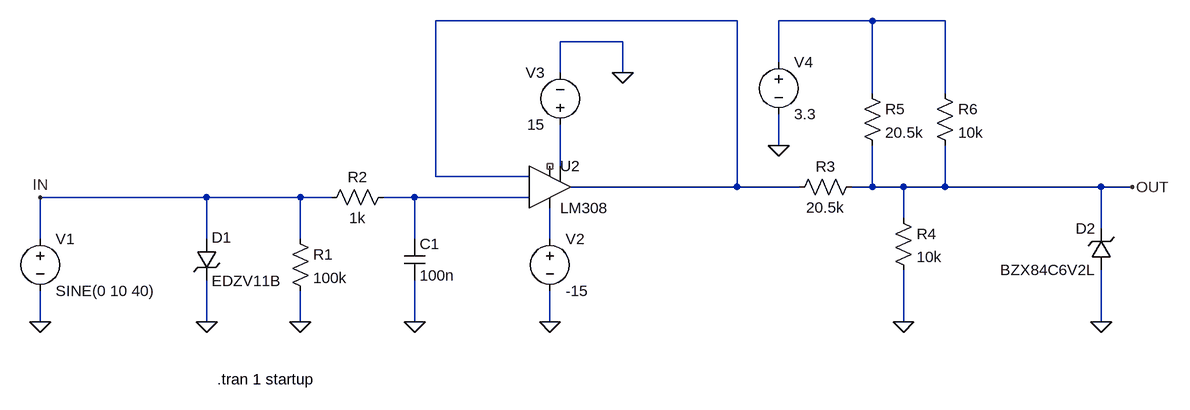
[diagram p0: schematic analog_input.asc]
analog_input.asc, the LTspice schematic file:
Version 4
SHEET 1 1540 680
WIRE 864 -208 400 -208
WIRE 1072 -208 928 -208
WIRE 1184 -208 1072 -208
WIRE 688 -176 592 -176
WIRE 928 -144 928 -208
WIRE 592 -128 592 -176
WIRE 688 -128 688 -176
WIRE 1072 -96 1072 -208
WIRE 1184 -96 1184 -208
WIRE 928 -16 928 -64
WIRE 592 16 592 -48
WIRE 400 32 400 -208
WIRE 544 32 400 32
WIRE 864 48 864 -208
WIRE 864 48 608 48
WIRE 960 48 864 48
WIRE 1072 48 1072 -16
WIRE 1072 48 1040 48
WIRE 1120 48 1072 48
WIRE 1184 48 1184 -16
WIRE 1184 48 1120 48
WIRE 1424 48 1184 48
WIRE 1472 48 1424 48
WIRE 48 64 -208 64
WIRE 192 64 48 64
WIRE 240 64 192 64
WIRE 368 64 320 64
WIRE 544 64 368 64
WIRE 1120 96 1120 48
WIRE 1424 112 1424 48
WIRE -208 128 -208 64
WIRE 48 128 48 64
WIRE 192 128 192 64
WIRE 368 128 368 64
WIRE 576 128 576 80
WIRE -208 256 -208 208
WIRE 48 256 48 192
WIRE 192 256 192 208
WIRE 368 256 368 192
WIRE 576 256 576 208
WIRE 1120 256 1120 176
WIRE 1424 256 1424 176
FLAG -208 256 0
FLAG 192 256 0
FLAG 368 256 0
FLAG 576 256 0
FLAG 688 -128 0
FLAG 1120 256 0
FLAG 928 -16 0
FLAG 1472 48 OUT
FLAG 48 256 0
FLAG 1424 256 0
FLAG -208 64 IN
SYMBOL voltage -208 112 R0
WINDOW 123 0 0 Left 0
WINDOW 39 0 0 Left 0
SYMATTR InstName V1
SYMATTR Value SINE(0 10 40)
SYMBOL res 176 112 R0
SYMATTR InstName R1
SYMATTR Value 100k
SYMBOL res 336 48 R90
WINDOW 0 0 56 VBottom 2
WINDOW 3 32 56 VTop 2
SYMATTR InstName R2
SYMATTR Value 1k
SYMBOL cap 352 128 R0
SYMATTR InstName C1
SYMATTR Value 100n
SYMBOL voltage 576 112 R0
WINDOW 123 0 0 Left 0
WINDOW 39 0 0 Left 0
SYMATTR InstName V2
SYMATTR Value -15
SYMBOL voltage 592 -32 R180
WINDOW 0 24 96 Left 2
WINDOW 3 24 16 Left 2
WINDOW 123 0 0 Left 0
WINDOW 39 0 0 Left 0
SYMATTR InstName V3
SYMATTR Value 15
SYMBOL res 1056 32 R90
WINDOW 0 0 56 VBottom 2
WINDOW 3 32 56 VTop 2
SYMATTR InstName R3
SYMATTR Value 20.5k
SYMBOL res 1104 80 R0
SYMATTR InstName R4
SYMATTR Value 10k
SYMBOL res 1056 -112 R0
SYMATTR InstName R5
SYMATTR Value 20.5k
SYMBOL res 1168 -112 R0
SYMATTR InstName R6
SYMATTR Value 10k
SYMBOL voltage 928 -160 R0
WINDOW 123 0 0 Left 0
WINDOW 39 0 0 Left 0
SYMATTR InstName V4
SYMATTR Value 3.3
SYMBOL zener 32 128 R0
WINDOW 0 24 -2 Left 2
WINDOW 3 24 65 Left 2
SYMATTR InstName D1
SYMATTR Value EDZV11B
SYMATTR Type tvsdiode
SYMBOL zener 1440 176 R180
WINDOW 0 24 64 Left 2
WINDOW 3 24 0 Left 2
SYMATTR InstName D2
SYMATTR Value BZX84C6V2L
SYMBOL OpAmps\\LM308 576 -16 R0
SYMATTR InstName U2
TEXT 64 344 Left 2 !.tran 1 startup

The netlist it stands for:
* analog_input.asc
V1 IN 0 SINE(0 10 40)
R1 IN 0 100k
R2 N004 IN 1k
C1 N004 0 100n
V2 N005 0 -15
V3 N003 0 15
R3 OUT N001 20.5k
R4 OUT 0 10k
R5 N002 OUT 20.5k
R6 N002 OUT 10k
V4 N002 0 3.3
D1 IN 0 EDZV11B
D2 0 OUT BZX84C6V2L
XU2 N004 N001 N003 N005 N001 NC_01 NC_02 LT1008
.model D D
.lib standard.dio
.tran 1 startup
.lib LTC.lib
.backanno
.end